# EasyEDA schematic SCH_51单片机土壤湿度传感器选型_2025-06-15.json
TITLE: 原理图1; REV: 1.0; Date: 2025-05-26; Sheet: 1/1; Drawn By: 高浩峻; Company: Your Company
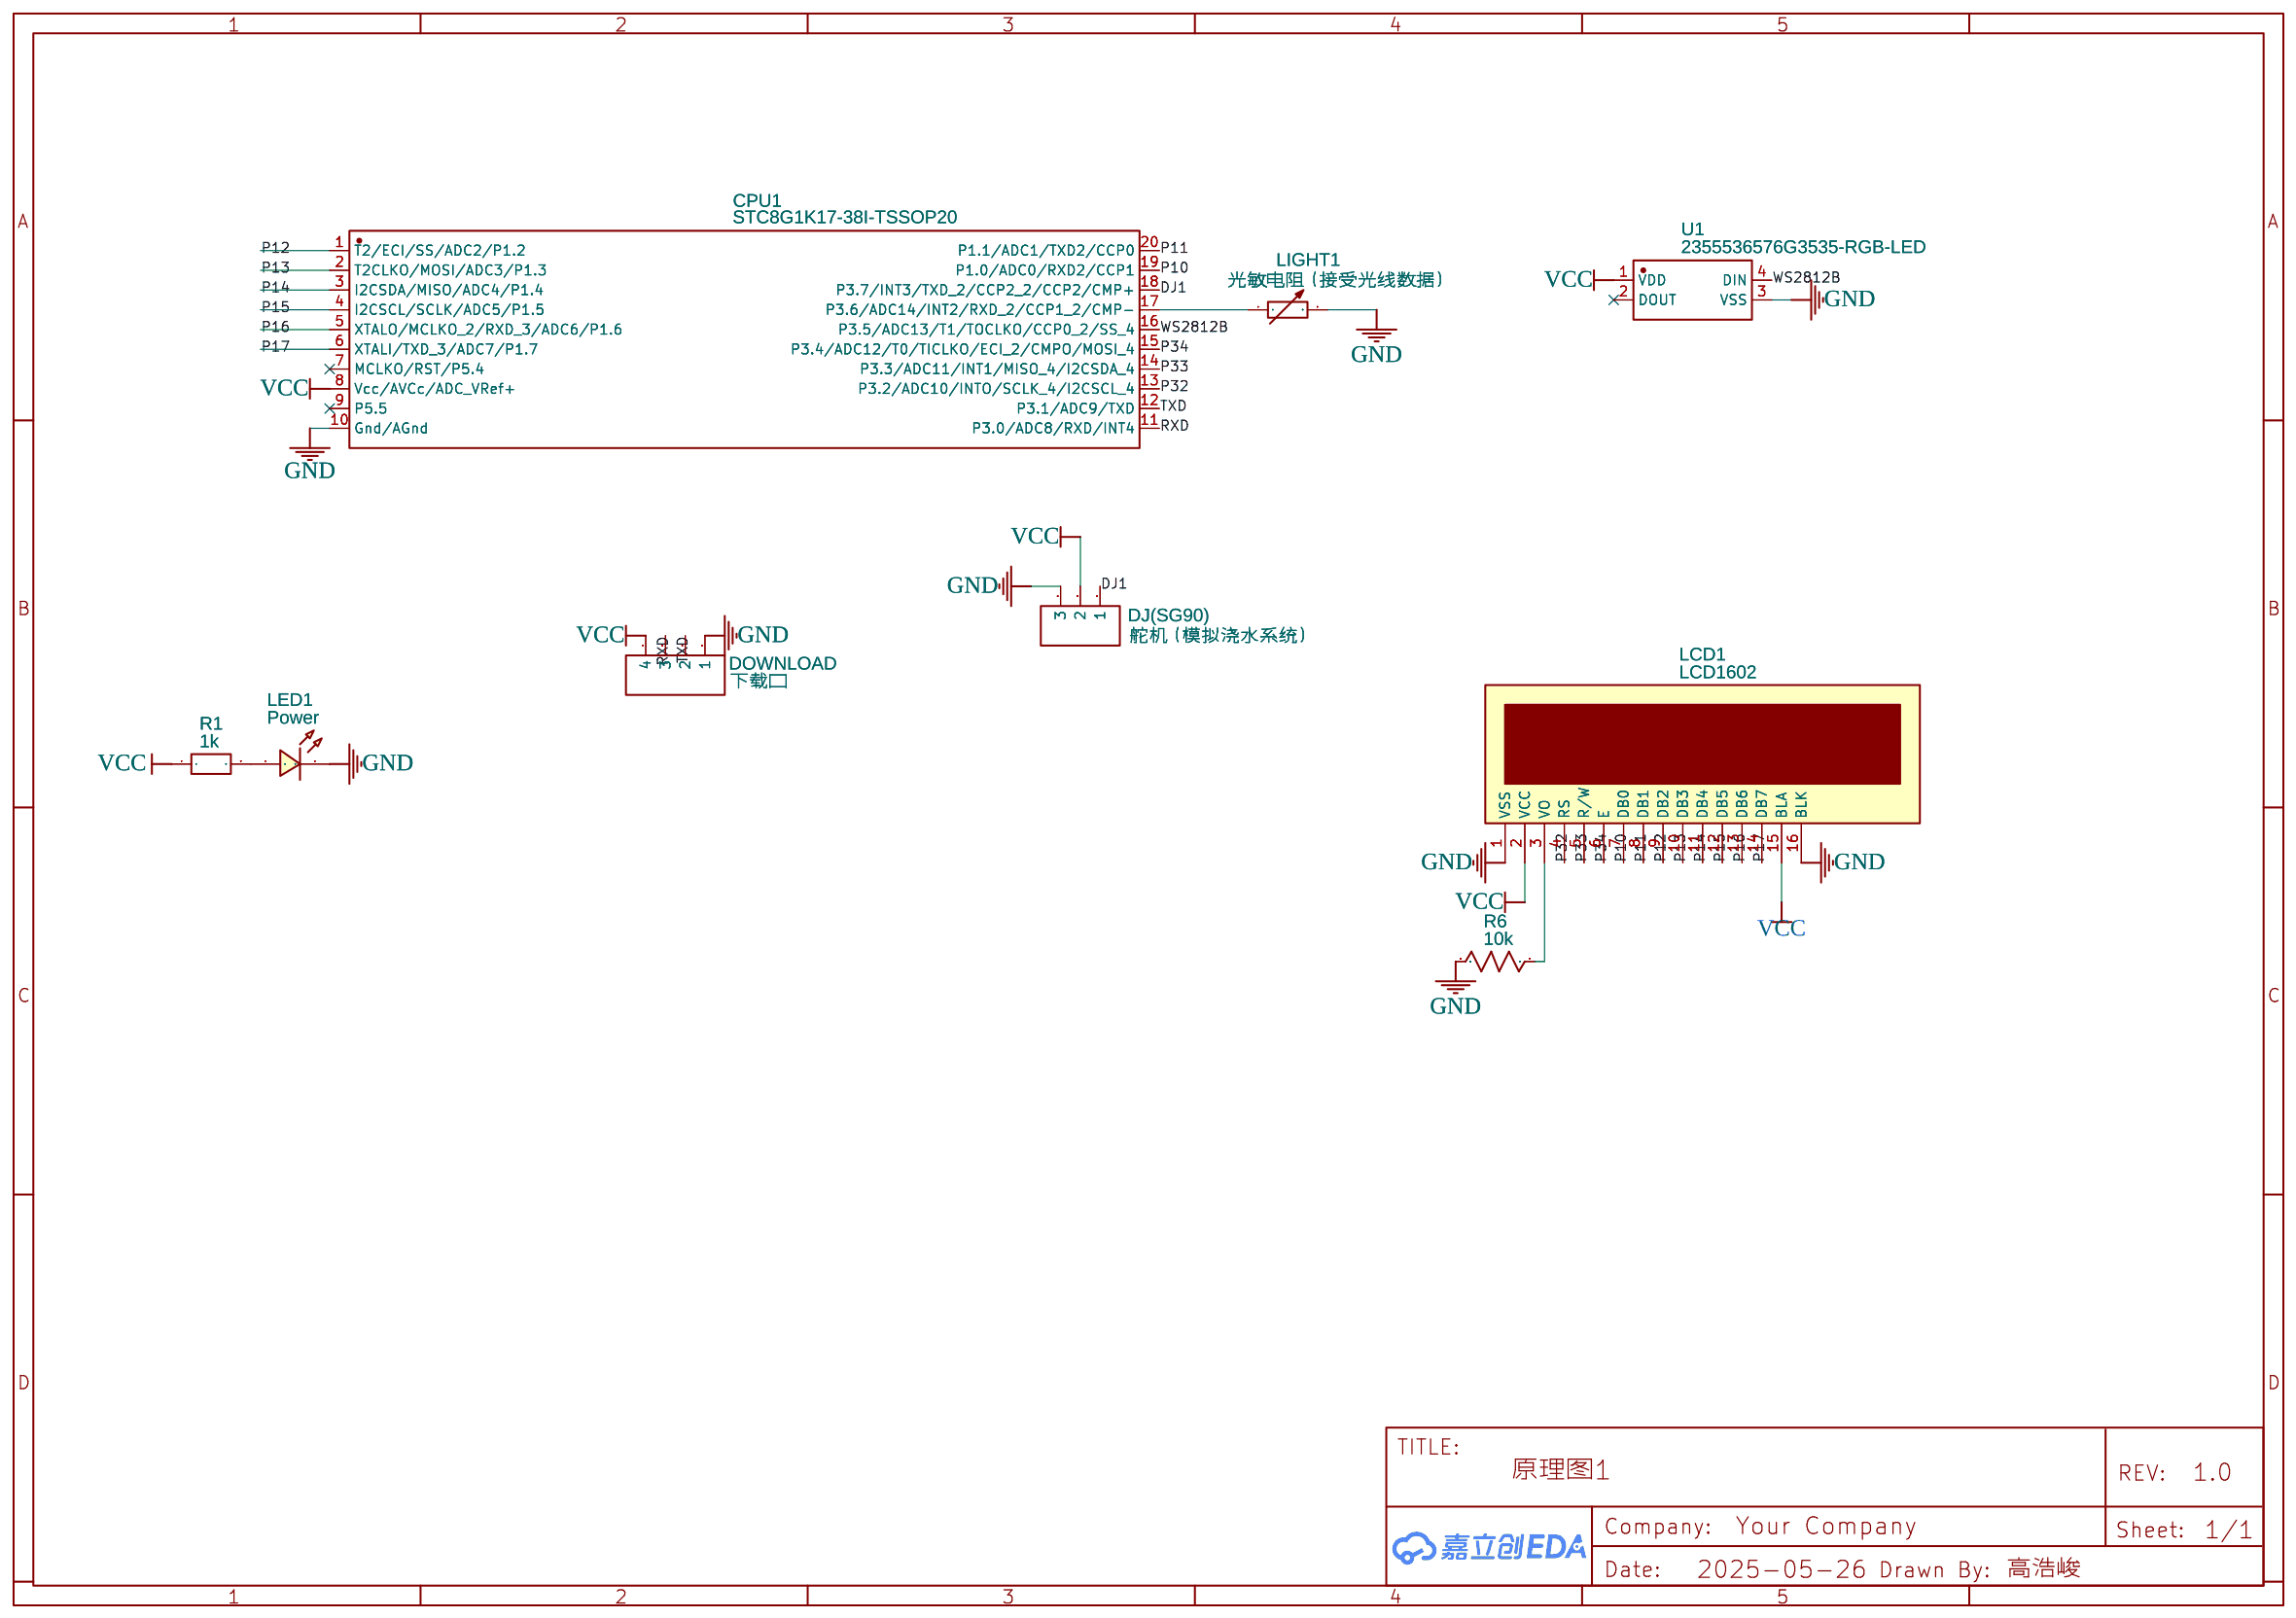
[diagram p0: schematic sheet]

## Parts
CPU1  STC8G1K17-38I-TSSOP20  [TSSOP-20_L6.5-W4.4-P0.65-LS6.4-BL]
DJ(SG90)  舵机（模拟浇水系统）  [HDR-F-2.54_1X3]
DOWNLOAD  下载口  [HDR-F-2.54_1X4]
LCD1  LCD1602  [LCD1602]
LED1  Power  [LED0603_RED]
LIGHT1  光敏电阻（接受光线数据）  [RES-TH_L4.9-W4.3-P3.4]
R1  1k  [R0603]
R6  10k  [R0805]
U1  2355536576G3535-RGB-LED  [LED-SMD_4P-L3.5-W3.5-BR_WS2812B]

## Library data of the parts
CPU1 = STC8G1K17-38I-TSSOP20: Contributor: LCSC; Supplier: LCSC; Supplier Part: C521759; Manufacturer: STC; JLCPCB Part Class: Extended Part
DJ(SG90) = HDR-F-2.54_1x3: Supplier Part: C146690; Supplier: LCSC; Contributor: LCEDA_Lib
DOWNLOAD = HDR-F-2.54_1x4: Supplier Part: C225501; Supplier: LCSC; Contributor: LCEDA_Lib
LCD1 = LCD1602: Manufacturer: LONTECH(厦门龙特); Manufacturer Part: LCM1602K-NSW-BBW; Supplier Part: C83275; Supplier: LCSC; Contributor: LCEDA_Lib
LED1 = LED-0603_R: Manufacturer: EVERLIGHT(台湾亿光); Manufacturer Part: 19-217/R6C-AL1M2VY/3T; Supplier Part: C72044; Supplier: LCSC; Contributor: LCEDA_01
LIGHT1 = 光敏电阻-5MM: Contributor: LCSC; Supplier: LCSC; Supplier Part: C9900003115; Manufacturer: null; JLCPCB Part Class: Extended Part
R1 = R_0603_EU: Contributor: LCEDA_Lib
R6 = R_0805_US: Contributor: LCEDA_Lib
U1 = 2355536576G3535-RGB-LED: Supplier: LCSC; Supplier Part: C9900111641; Manufacturer: null; Contributor: lcsc; JLCPCB Part Class: Extended Part

## Nets
GND: CPU1.10(Gnd/AGnd) DJ(SG90).3 DOWNLOAD.1 LCD1.1(VSS) LCD1.16(BLK) LED1.2 LIGHT1.2 R6.2 U1.3(VSS)
VCC: CPU1.8(Vcc/AVCc/ADC_VRef+) DJ(SG90).2 DOWNLOAD.4 LCD1.2(VCC) LCD1.15(BLA) R1.1 U1.1(VDD)
DJ1: CPU1.18(P3.7/INT3/TXD_2/CCP2_2/CCP2/CMP+) DJ(SG90).1
P10: CPU1.19(P1.0/ADC0/RXD2/CCP1) LCD1.7(DB0)
P11: CPU1.20(P1.1/ADC1/TXD2/CCP0) LCD1.8(DB1)
P12: CPU1.1(T2/ECI/SS/ADC2/P1.2) LCD1.9(DB2)
P13: CPU1.2(T2CLKO/MOSI/ADC3/P1.3) LCD1.10(DB3)
P14: CPU1.3(I2CSDA/MISO/ADC4/P1.4) LCD1.11(DB4)
P15: CPU1.4(I2CSCL/SCLK/ADC5/P1.5) LCD1.12(DB5)
P16: CPU1.5(XTALO/MCLKO_2/RXD_3/ADC6/P1.6) LCD1.13(DB6)
P17: CPU1.6(XTALI/TXD_3/ADC7/P1.7) LCD1.14(DB7)
P32: CPU1.13(P3.2/ADC10/INTO/SCLK_4/I2CSCL_4) LCD1.4(RS)
P33: CPU1.14(P3.3/ADC11/INT1/MISO_4/I2CSDA_4) LCD1.5(R/W)
P34: CPU1.15(P3.4/ADC12/T0/TICLKO/ECI_2/CMPO/MOSI_4) LCD1.6(E)
RXD: CPU1.11(P3.0/ADC8/RXD/INT4) DOWNLOAD.3
TXD: CPU1.12(P3.1/ADC9/TXD) DOWNLOAD.2
WS2812B: CPU1.16(P3.5/ADC13/T1/TOCLKO/CCP0_2/SS_4) U1.4(DIN)
Net-(CPU1-17): CPU1.17(P3.6/ADC14/INT2/RXD_2/CCP1_2/CMP-) LIGHT1.1
Net-(LCD1-3): LCD1.3(VO) R6.1
Net-(LED1-1): LED1.1 R1.2

Not connected (* = marked no-connect by the designer): CPU1 7(MCLKO/RST/P5.4)* 9(P5.5)*; U1 2(DOUT)*
